# Altium schematic sheet Microcontroller.SchDoc
size B; Organization: Altium Limited; Address1: L3, 12a Rodborough Rd; Address2: Frenchs Forest; Address3: NSW; Address4: Australia 2086
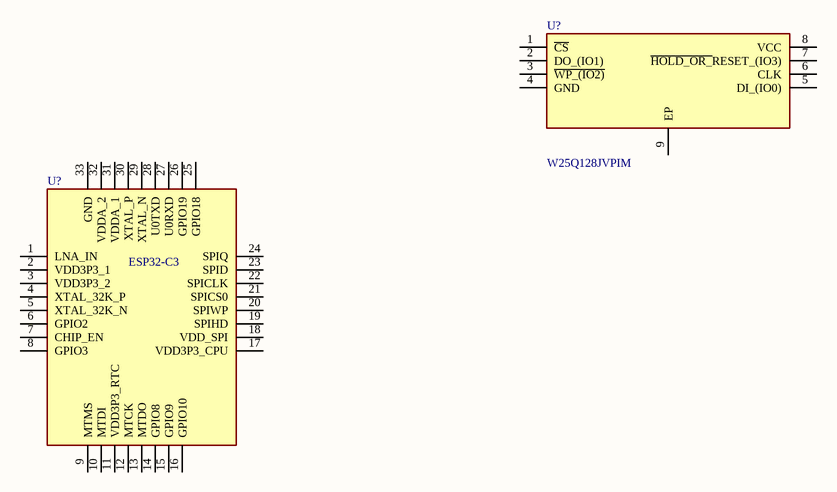
[diagram p0: Microcontroller.SchDoc]

## Parts
(Parts that share a designator on the sheet are numbered #1, #2 ... from top to bottom, then left to right.)
U?#1  W25Q128JVPIM  [SON127P600X500X80-9N-D]
U?#2  ESP32-C3  [QFN50P500X500X90-33N-D]

## Nets

Not connected (* = marked no-connect by the designer): U?#1 1(~{CS}) 2(DO_(IO1)) 3(~{WP_(IO2)}) 4(GND) 5(DI_(IO0)) 6(CLK) 7(~{HOLD_OR_}RESET_(IO3)) 8(VCC) 9(EP); U?#2 1(LNA_IN) 2(VDD3P3_1) 3(VDD3P3_2) 4(XTAL_32K_P) 5(XTAL_32K_N) 6(GPIO2) 7(CHIP_EN) 8(GPIO3) 9(MTMS) 10(MTDI) 11(VDD3P3_RTC) 12(MTCK) 13(MTDO) 14(GPIO8) 15(GPIO9) 16(GPIO10) 17(VDD3P3_CPU) 18(VDD_SPI) 19(SPIHD) 20(SPIWP) 21(SPICS0) 22(SPICLK) 23(SPID) 24(SPIQ) 25(GPIO18) 26(GPIO19) 27(U0RXD) 28(U0TXD) 29(XTAL_N) 30(XTAL_P) 31(VDDA_1) 32(VDDA_2) 33(GND)

## Notes on the sheet
- Title
- Size:
- Date:
- B
- Number:
- Time:
- Revision:
- Sheet
- of
- File:

## Library data of the parts
U?#1 = W25Q128JVPIM: 128M-bit Serial Flash Memory with uniform 4KB sectors and Dual/Quad SPI; Manufacturer_Name: Winbond; Geometry.Height: 0.8mm; Mouser Part Number: 454-W25Q128JVPIM; Mouser Price/Stock: https://www.mouser.co.uk/ProductDetail/Winbond/W25Q128JVPIM?qs=qSfuJ%252Bfl%2Fd62hi5N%252Bd7%252B%252BA%3D%3D; Manufacturer_Part_Number: W25Q128JVPIM; Datasheet Link: https://www.winbond.com/hq/search-resource-file.jsp?partNo=W25Q128JVPIM&type=datasheet
U?#2 = ESP32-C3: Ultra-Low-Power SoC with RISC-V Single-Core CPU; Manufacturer_Name: Espressif Systems; Geometry.Height: 0.9mm; Mouser Part Number: 356-ESP32-C3; Mouser Price/Stock: https://www.mouser.co.uk/ProductDetail/Espressif-Systems/ESP32-C3?qs=iLbezkQI%252BsiMXe7tMG%252Bo%2FA%3D%3D; Manufacturer_Part_Number: ESP32-C3; Datasheet Link: https://www.espressif.com/sites/default/files/documentation/esp32-c3_datasheet_en.pdf